# EasyEDA schematic Schematics EasyEDA.json

## Sheets
1 Schematic: TITLE: Arduino Current Logger; REV: 1.0; Date: 2024-07-06; Sheet: 1/1; Drawn By: Ed F
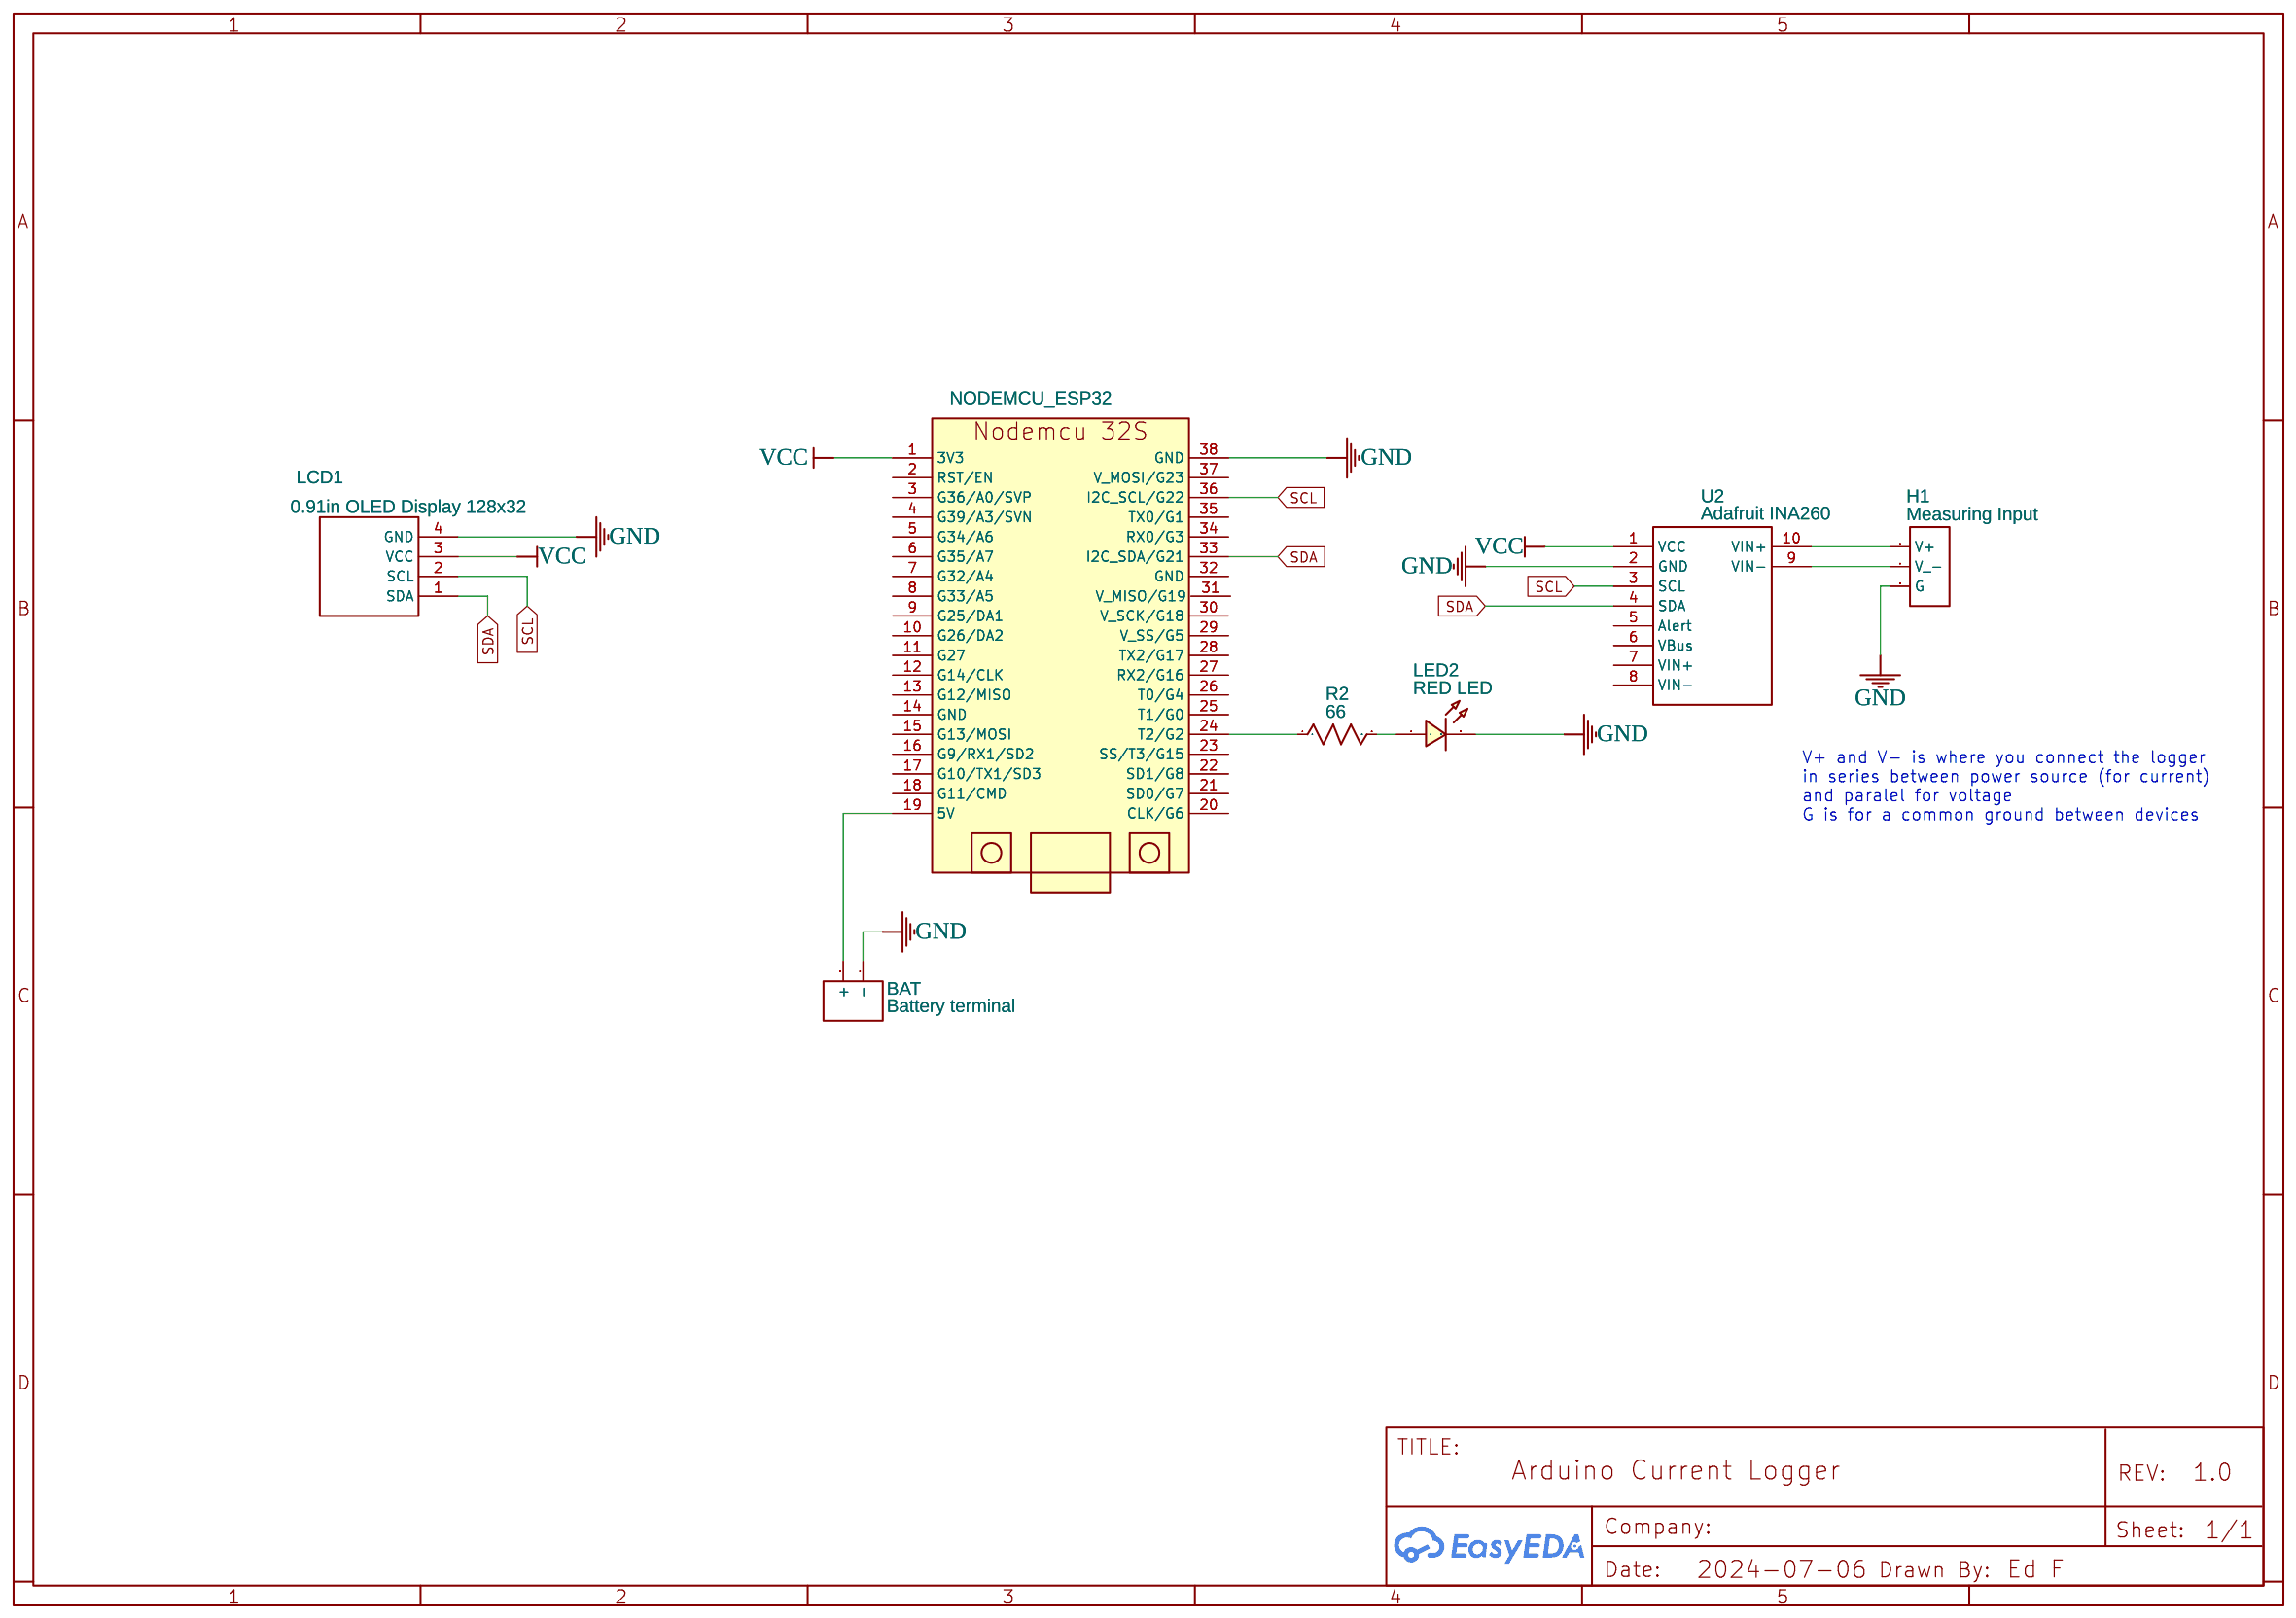
[diagram p0: Schematic]
2 Usage Schematic: TITLE: Usage schematic; Date: 2024-07-08; Drawn By: Memz xx; Company: Your Company
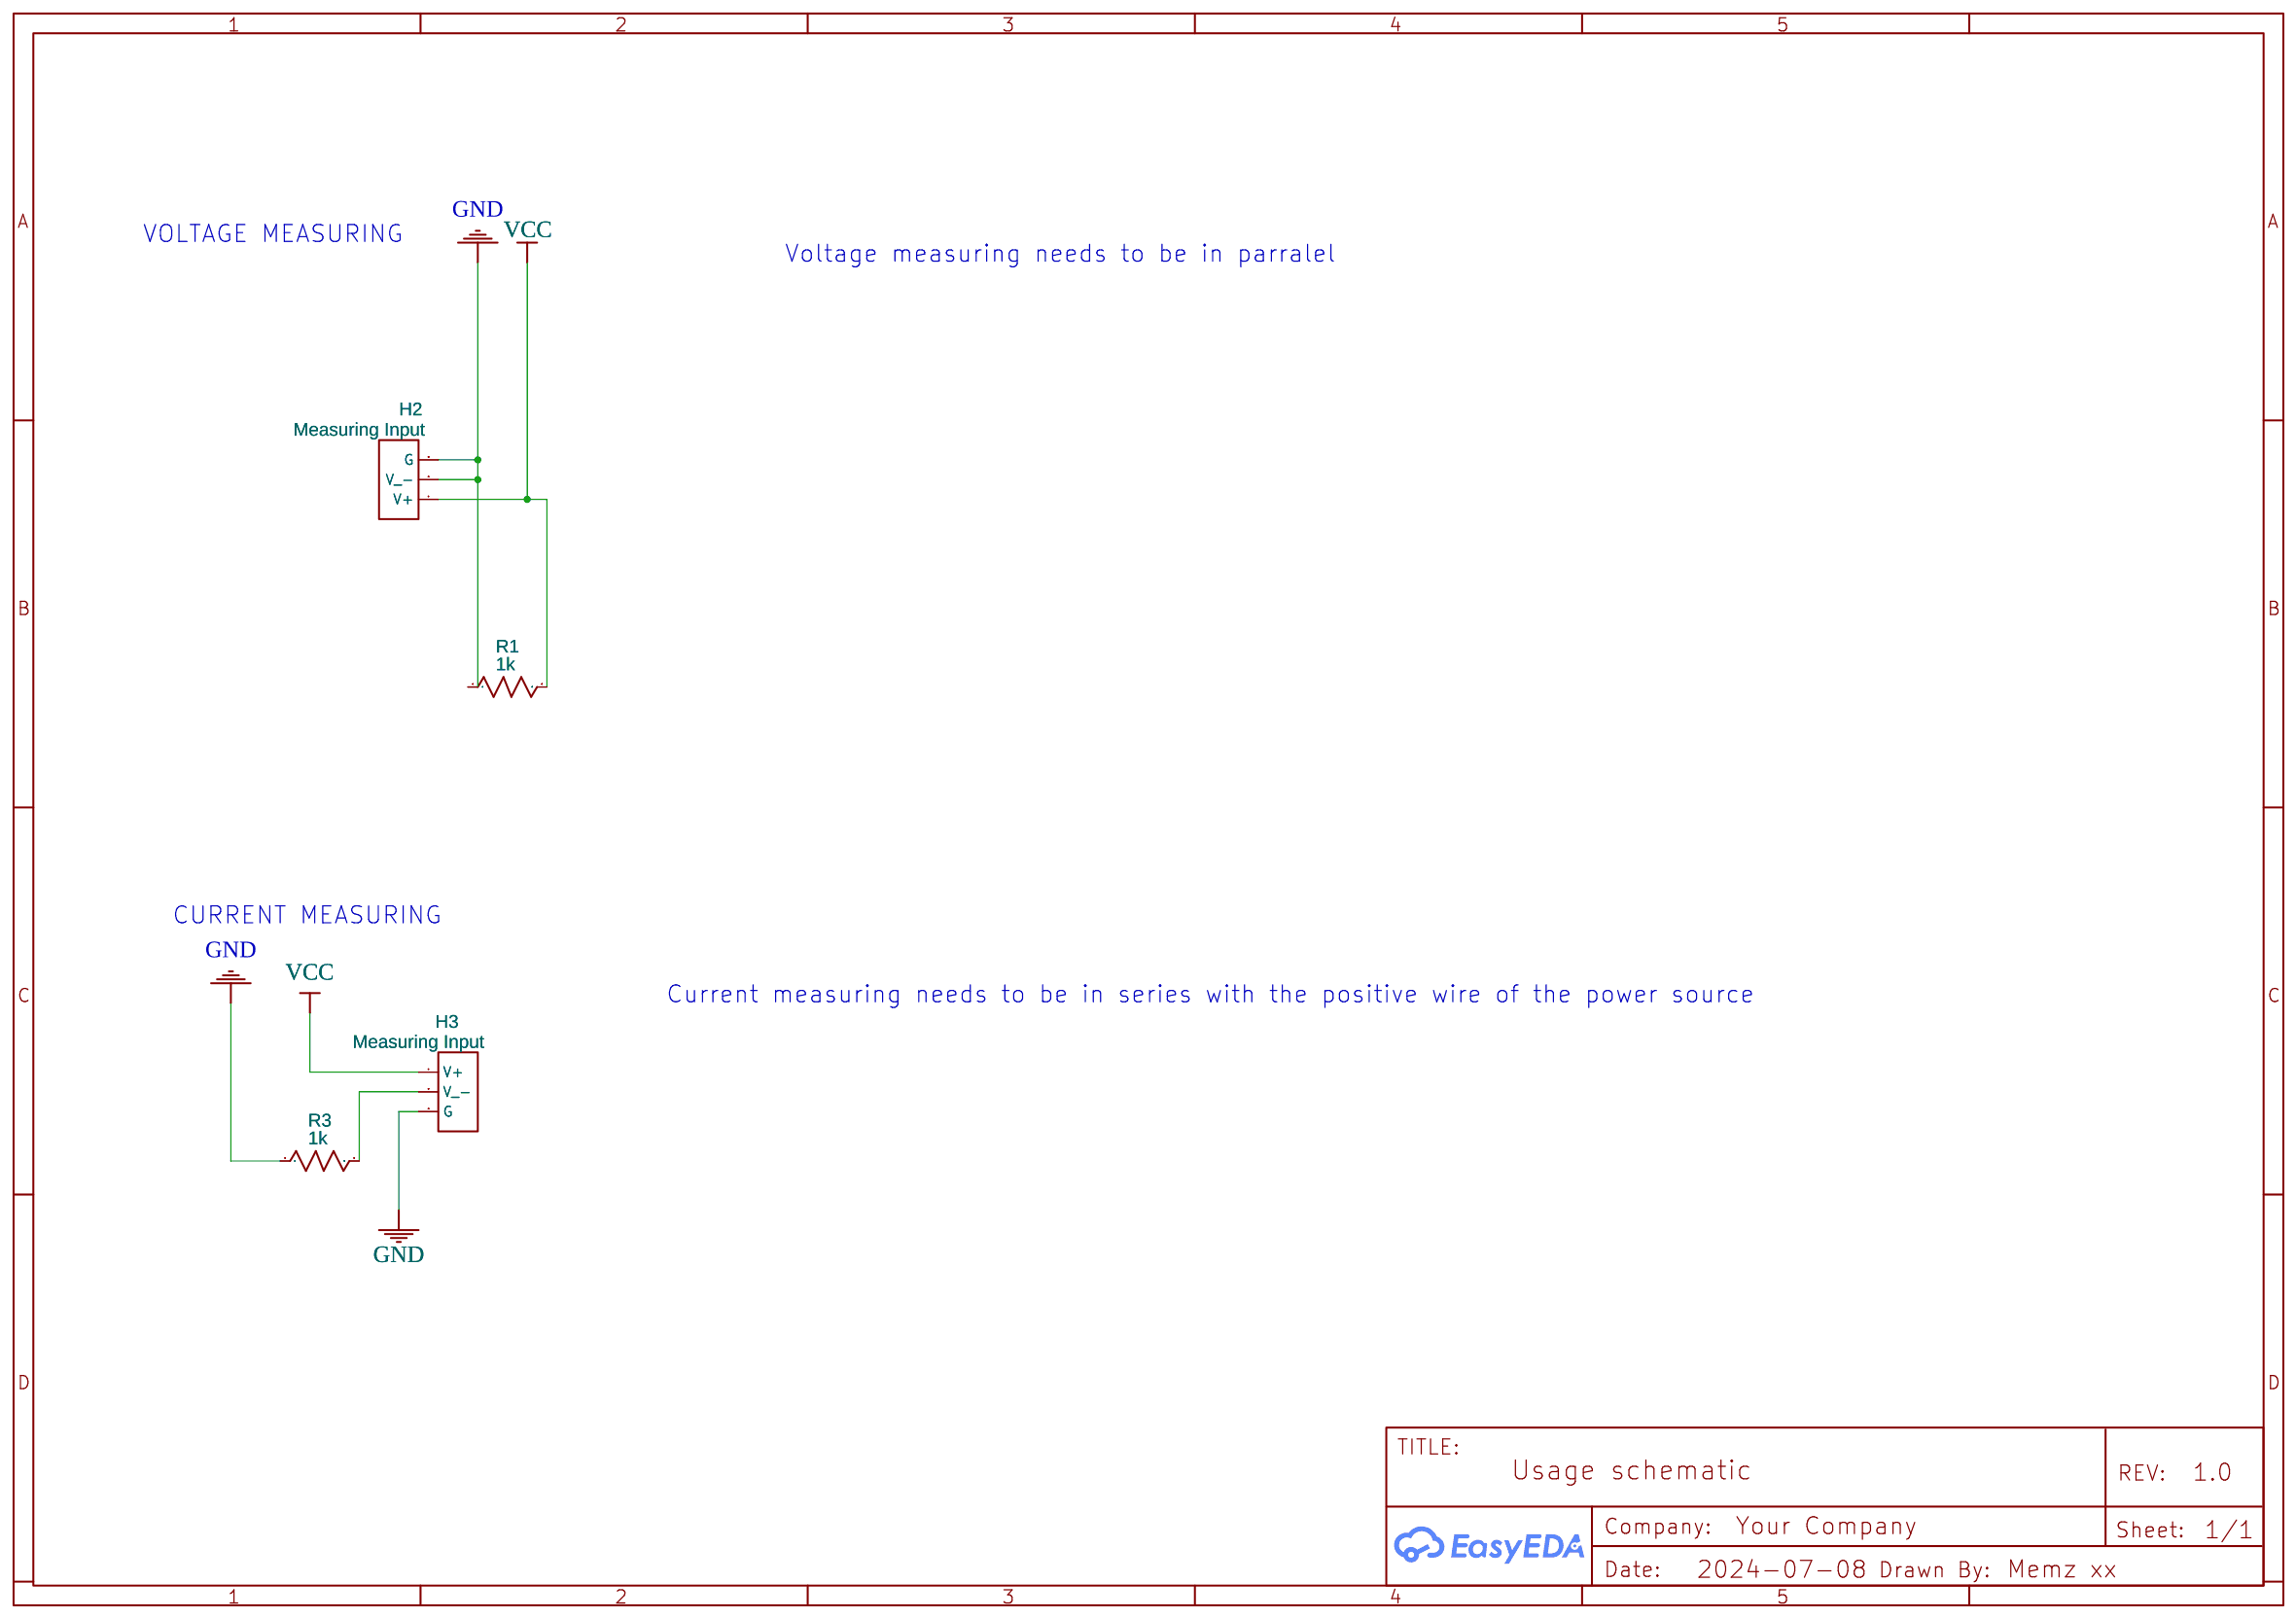
[diagram p1: Usage Schematic]

## Parts
sheet Schematic
BAT  Battery terminal  [HDR-F-2.54_1X2]
H1  Measuring Input  [HDR-F-2.54_1X3]
LCD1  0.91in OLED Display 128x32  [DISPLAY_OLED_128X32_I2C]
LED2  RED LED  [LED0603_RED]
R2  66  [R0603]
U1  NODEMCU_ESP32  [NODEMCU-ESP32S-CORRECT3]  (section 1)
U2  Adafruit INA260  [ADAFRUIT_INA260]
sheet Usage Schematic
H2  Measuring Input  [HDR-F-2.54_1X3]
H3  Measuring Input  [HDR-F-2.54_1X3]
R1  1k  [R0603]
R3  1k  [R0603]

## Library data of the parts
BAT = HDR-F-2.54_1x2: Supplier Part: C49661; Supplier: LCSC; Contributor: LCEDA_Lib
H1-H3 = HDR-F-2.54_1x3: Supplier Part: C146690; Supplier: LCSC; Contributor: LCEDA_Lib
LCD1 = 0.91in OLED Display 128x32: Manufacturer: HiLetgo; Contributor: Mimosa
LED2 = LED-0603_R: Manufacturer: EVERLIGHT(台湾亿光); Manufacturer Part: 19-217/R6C-AL1M2VY/3T; Supplier Part: C72044; Supplier: LCSC; Contributor: LCEDA_01
R1-R3 = R_0603_US: Contributor: LCEDA_Lib
U1 = NODEMCU_ESP32-RUSS COPY COPY: Manufacturer Part: Nodemcu esp32; Contributor: Russ de Ment; subpart_no: 1
U2 = Adafruit INA260: Manufacturer: Adafruit; Manufacturer Part: 4226; Supplier: Mouser; Supplier Part: ADA-4226; link: https://www.adafruit.com/product/4226; Contributor: tan.ismail1984

## Nets
GND: BAT.1(-) H1.3(G) H2.2(V -) H2.3(G) H3.3(G) LCD1.4(GND) LED2.2 R1.1 R3.1 U1.38(GND) U2.2(GND)
VCC: H2.1(V+) H3.1(V+) LCD1.3(VCC) R1.2 U1.1(3V3) U2.1(VCC)
SCL: LCD1.2(SCL) U1.36(I2C SCL/G22) U2.3(SCL)
SDA: LCD1.1(SDA) U1.33(I2C SDA/G21) U2.4(SDA)
Net-(BAT-2): BAT.2(+) U1.19(5V)
Net-(H1-1): H1.1(V+) U2.10(VIN+)
Net-(H1-2): H1.2(V -) U2.9(VIN-)
Net-(H3-2): H3.2(V -) R3.2
Net-(LED2-1): LED2.1 R2.2
Net-(R2-1): R2.1 U1.24(T2/G2)

Not connected (* = marked no-connect by the designer): U1 2(RST/EN) 3(G36/A0/SVP) 4(G39/A3/SVN) 5(G34/A6) 6(G35/A7) 7(G32/A4) 8(G33/A5) 9(G25/DA1) 10(G26/DA2) 11(G27) 12(G14/CLK) 13(G12/MISO) 14(GND) 15(G13/MOSI) 16(G9/RX1/SD2) 17(G10/TX1/SD3) 18(G11/CMD) 20(CLK/G6) 21(SD0/G7) 22(SD1/G8) 23(SS/T3/G15) 25(T1/G0) 26(T0/G4) 27(RX2/G16) 28(TX2/G17) 29(V_SS/G5) 30(V_SCK/G18) 31(V_MISO/G19) 32(GND) 34(RX0/G3) 35(TX0/G1) 37(V_MOSI/G23); U2 5(Alert) 6(VBus) 7(VIN+) 8(VIN-)

## Notes on the sheets
sheet 1
- V+ and V- is where you connect the logger
  in series between power source (for current)
  and paralel for voltage
  G is for a common ground between devices
sheet 2
- VOLTAGE MEASURING
- Voltage measuring needs to be in parralel
- CURRENT MEASURING
- Current measuring needs to be in series with the positive wire of the power source
